# Altium schematic sheet 03_Module.SchDoc
size 297 x 209 mm
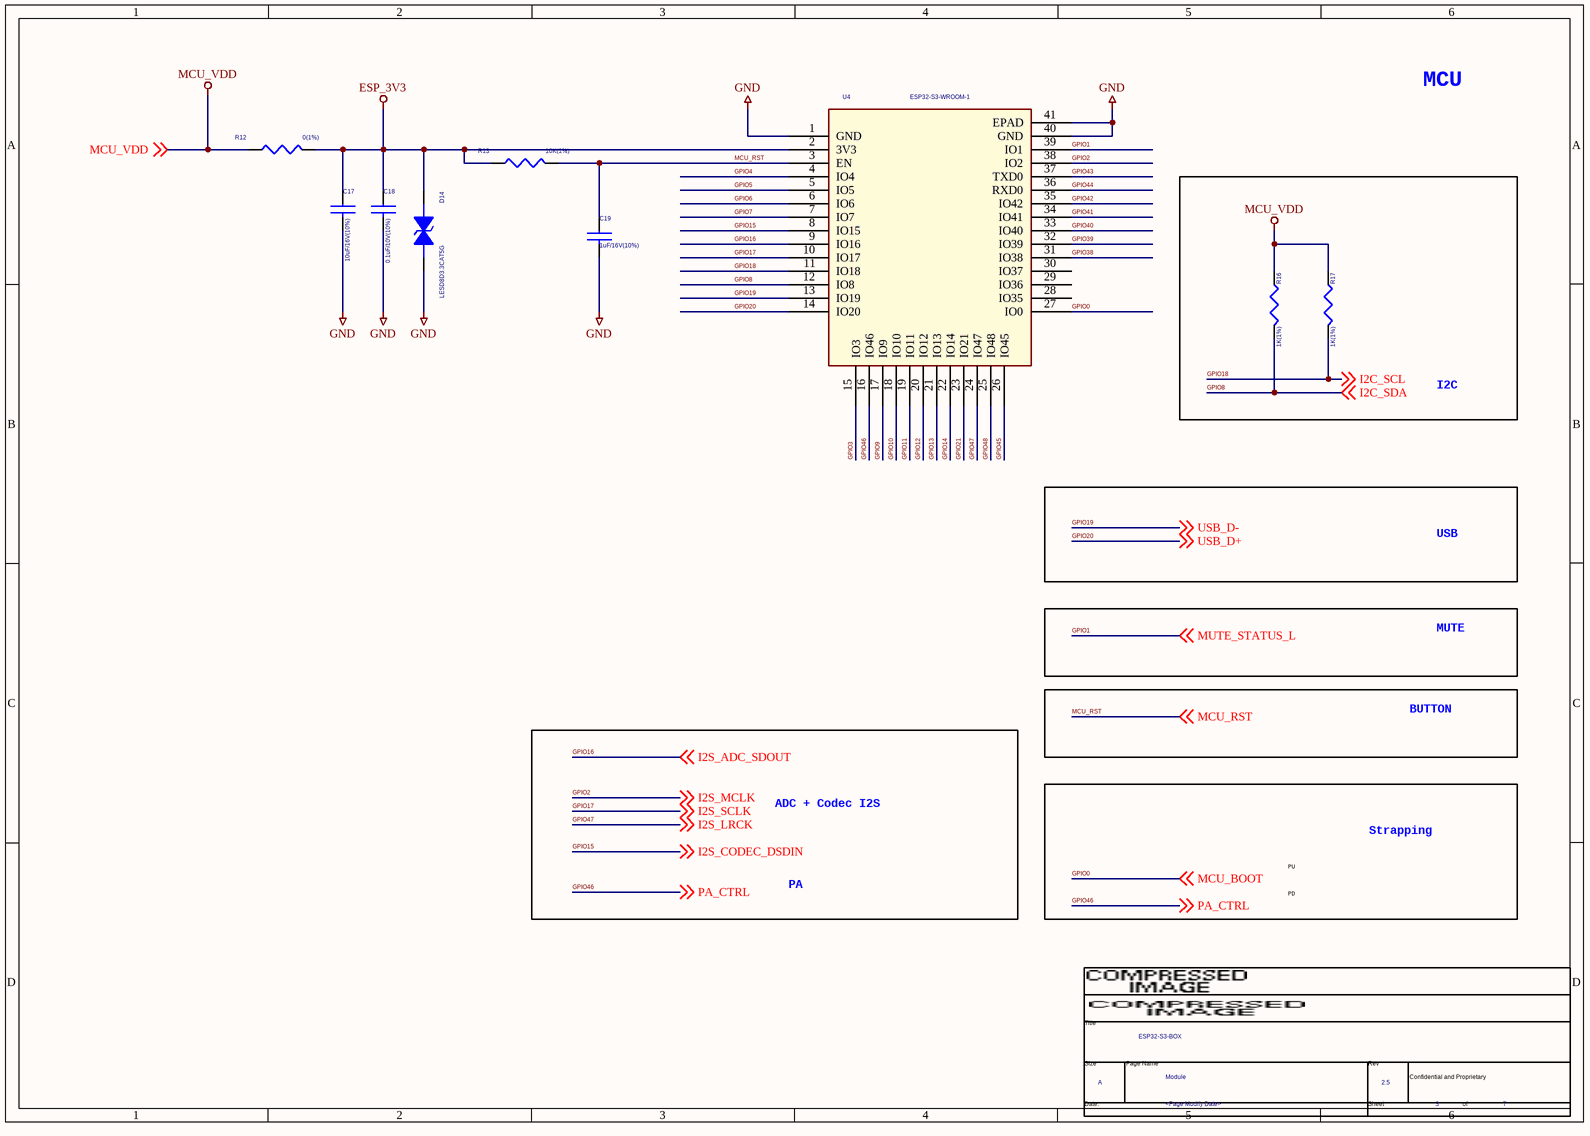
[diagram p0: 03_Module.SchDoc]

## Parts
*  Page Modify Date: <Page Modify Date>  Page Name: Module  Title: ESP32-S3-BOX  Page Size: A  Page Number: 3  Page Count: 7  RevCode: 2.5  (hidden comment: espTitleBlock3)  (graphical)
C17  10uF/16V(10%)  [C0603]
C18  0.1uF/10V(10%)  [C0402]
C19  1uF/16V(10%)  [C0402]
D14  LESD8D3.3CAT5G  [SOD882]
R12  0(1%)  [R0603]
R13  10K(1%)  [R0402]
R16  1K(1%)  [R0201]
R17  1K(1%)  [R0201]
U4  ESP32-S3-WROOM-1  [ESP32-S3-WROOM]

## Blocks framed on the sheet
I2C: R16 R17

## Nets
ESP_3V3: C17.1 C18.1 D14.2 R12.2 R13.1 U4.2(3V3)
GND: C17.2 C18.2 C19.2 D14.1 U4.1(GND) U4.40(GND) U4.41(EPAD)
MCU_VDD: R12.1 R16.1 R17.1 ; off-sheet MCU_VDD
GPIO0: U4.27(IO0) ; off-sheet MCU_BOOT  [also labelled MCU_BOOT]
GPIO1: U4.39(IO1) ; off-sheet MUTE_STATUS_L  [also labelled MUTE_STATUS_L]
GPIO2: U4.38(IO2) ; off-sheet I2S_MCLK  [also labelled I2S_MCLK]
GPIO3: U4.15(IO3)
GPIO4: U4.4(IO4)
GPIO5: U4.5(IO5)
GPIO6: U4.6(IO6)
GPIO7: U4.7(IO7)
GPIO8: R16.2 U4.12(IO8) ; off-sheet I2C_SDA  [also labelled I2C_SDA]
GPIO9: U4.17(IO9)
GPIO10: U4.18(IO10)
GPIO11: U4.19(IO11)
GPIO12: U4.20(IO12)
GPIO13: U4.21(IO13)
GPIO14: U4.22(IO14)
GPIO15: U4.8(IO15) ; off-sheet I2S_CODEC_DSDIN  [also labelled I2S_CODEC_DSDIN]
GPIO16: U4.9(IO16) ; off-sheet I2S_ADC_SDOUT  [also labelled I2S_ADC_SDOUT]
GPIO17: U4.10(IO17) ; off-sheet I2S_SCLK  [also labelled I2S_SCLK]
GPIO18: R17.2 U4.11(IO18) ; off-sheet I2C_SCL  [also labelled I2C_SCL]
GPIO19: U4.13(IO19) ; off-sheet USB_D-  [also labelled USB_D-]
GPIO20: U4.14(IO20) ; off-sheet USB_D+  [also labelled USB_D+]
GPIO21: U4.23(IO21)
GPIO38: U4.31(IO38)
GPIO39: U4.32(IO39)
GPIO40: U4.33(IO40)
GPIO41: U4.34(IO41)
GPIO42: U4.35(IO42)
GPIO43: U4.37(TXD0)
GPIO44: U4.36(RXD0)
GPIO45: U4.26(IO45)
GPIO46: U4.16(IO46) ; off-sheet PA_CTRL  [also labelled PA_CTRL]
GPIO47: U4.24(IO47) ; off-sheet I2S_LRCK  [also labelled I2S_LRCK]
GPIO48: U4.25(IO48)
MCU_RST: C19.1 R13.2 U4.3(EN) ; off-sheet MCU_RST

Not connected (* = marked no-connect by the designer): U4 28(IO35) 29(IO36) 30(IO37)

## Notes on the sheet
- MCU
- USB
- MUTE
- BUTTON
- ADC + Codec I2S
- PU
- Strapping
- PA
- PD
- (in symbol espTitleBlock3) Title; Size; Page Name; Rev; Confidential and Proprietary; Date:; Sheet; of

## Library data of the parts
* = espTitleBlock3: Doc: ESP32-S3-EYE_V1.0; OrgName: ESPRESSIF
C17 = CAPACITOR: Part Number: ES11067104600000; CODE12: ES11.06.710.4.6.0.00; Part Type: Capacitor
C18 = CAPACITOR: Part Number: ES11045103620000; CODE12: ES11.04.510.3.6.2.00; Part Type: Capacitor
C19 = CAPACITOR: Part Number: ES11046104610000; CODE12: ES11.04.610.4.6.1.00; Part Type: Capacitor
D14 = DIODE_BI_DIR: Part Number: ES31320010000000; CODE12: ES31.32.0010.00.0.0; Part Type: Diode
R12 = RESISTOR: Part Number: ES21060000000001; CODE12: ES21.06.0000.0.00.0; Part Type: Resistor
R13 = RESISTOR: Part Number: ES21044100000001; CODE12: ES21.04.4100.0.00.0; Part Type: Resistor
R16 R17 = RESISTOR: Part Number: ES21023100000001; CODE12: ES21.02.3100.0.00.0; Part Type: Resistor
U4 = ESP32-S3-WROOM